# Altium schematic sheet COMMUNICATION.SchDoc
size A4; Author: Induja N/Karthik R; SheetNumber: 6; SheetTotal: 7
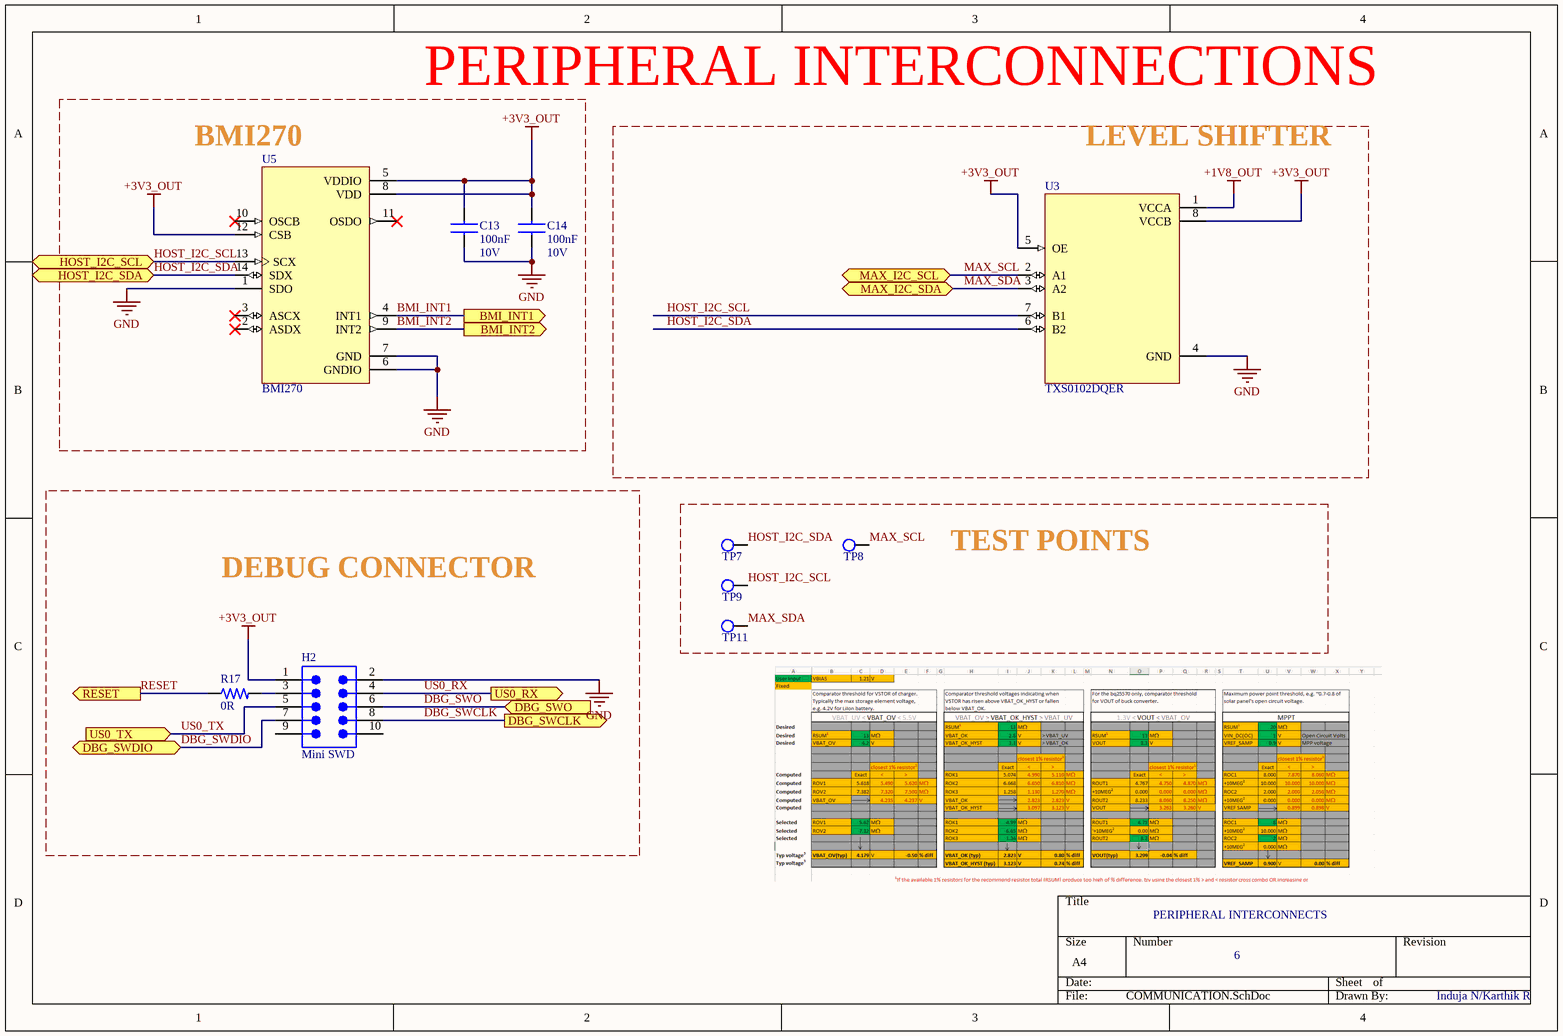
[diagram p0: COMMUNICATION.SchDoc]

## Parts
C13  value 100nF  Voltage Rating (DC): 10V  [CAP_0603_1MM]  (hidden comment: CAP 0.1uF 0603)
C14  value 100nF  Voltage Rating (DC): 10V  [CAP_0603_1MM]  (hidden comment: CAP 0.1uF 0603)
H2  Mini SWD  [FTSH-105-01-XXX-DV-K]
R17  value 0R  [RES_0603_1608X06]  (hidden comment: RES 0R 0603)
TP7  Test Point  [Test Point]  (value not drawn)  (net tie, no BOM)
TP8  Test Point  [Test Point]  (value not drawn)  (net tie, no BOM)
TP9  Test Point  [Test Point]  (value not drawn)  (net tie, no BOM)
TP11  Test Point  [Test Point]  (value not drawn)  (net tie, no BOM)
U3  TXS0102DQER  [SON35P140X100X40-8N]
U5  BMI270  [XDCR_BMI270]

## Blocks framed on the sheet
PERIPHERAL INTERCONNECTIONS: C13 C14 U5
LEVEL SHIFTER: U3
DEBUG CONNECTOR: H2 R17
TEST POINTS: TP7-TP9 TP11

## Ports
BMI_INT1 (out, see EFR32BG13_INTERCONNECTS[3C]), BMI_INT2 (out, see EFR32BG13_INTERCONNECTS[3C]), DBG_SWCLK (out, see EFR32BG13_INTERCONNECTS[3C]), DBG_SWDIO (bidir, see EFR32BG13_INTERCONNECTS[3C]), DBG_SWO (in, see EFR32BG13_INTERCONNECTS[3C]), HOST_I2C_SCL (bidir, see EFR32BG13_INTERCONNECTS[3B]), HOST_I2C_SDA (bidir, see EFR32BG13_INTERCONNECTS[3B]), MAX_I2C_SCL (bidir, see HEART_RATE[1B]), MAX_I2C_SDA (bidir, see HEART_RATE[1B]), RESET (out, see EFR32G13_POWER_RESET[1A]), US0_RX (out, see EFR32BG13_INTERCONNECTS[3C]), US0_TX (in, see EFR32BG13_INTERCONNECTS[3C])

## Nets
+1V8_OUT: U3.1(VCCA)
+3V3_OUT: C13.1 C14.1 H2.1 U3.5(OE) U3.8(VCCB) U5.5(VDDIO) U5.8(VDD) U5.12(CSB)
GND: C13.2 C14.2 H2.2 U3.4(GND) U5.1(SDO) U5.6(GNDIO) U5.7(GND)
BMI_INT1: U5.4(INT1) ; port BMI_INT1
BMI_INT2: U5.9(INT2) ; port BMI_INT2
DBG_SWCLK: H2.8 ; port DBG_SWCLK
DBG_SWDIO: H2.7 ; port DBG_SWDIO
DBG_SWO: H2.6 ; port DBG_SWO
HOST_I2C_SCL: TP9.1 U3.7(B1) U5.13(SCX) ; port HOST_I2C_SCL
HOST_I2C_SDA: TP7.1 U3.6(B2) U5.14(SDX) ; port HOST_I2C_SDA
MAX_SCL: TP8.1 U3.2(A1) ; port MAX_I2C_SCL
MAX_SDA: TP11.1 U3.3(A2) ; port MAX_I2C_SDA
RESET: R17.1 ; port RESET
US0_RX: H2.4 ; port US0_RX
US0_TX: H2.5 ; port US0_TX
NetH2_3: H2.3 R17.2

Not connected (* = marked no-connect by the designer): H2 9 10; U5 2(ASDX)* 3(ASCX)* 10(OSCB)* 11(OSDO)*

## Notes on the sheet
- (near U5) BMI270
- PERIPHERAL INTERCONNECTS

## Library data of the parts
C13 C14 = CAP 0.1uF 0603: 0603 0.1 uF 10 V ±10% Tolerance X7R SMT Multilayer Ceramic Chip Capacitor; Manufacturer: Vishay; Manufacturer Part Number: VJ0603Y104KXQCW1BC; Supplier: Newark; Supplier Part Number: 77AK2911; RoHS: Compliant; Category: Ceramic Capacitors; Stock: 20000; Pricing: 4000=0.028, 8000=0.026 (USD); Case/Package: 0603; Case Code (Imperial): 0603; Case Code (Metric): 1608; China RoHS: Compliant; Depth: 800µm; Dielectric: X7R; Dielectric Material: Ceramic; Height: 870µm; Lead Free: Lead Free; Length: 1.6mm; Lifecycle Status: Production; Max Operating Temperature: 125°C; Min Operating Temperature: -55°C; Mounting Technology: Surface Mount; Number of Terminals: 2; REACH SVHC: Yes; Schedule B: 8532240020, 8532240020|8532240020|8532240020|8532240020|8532240020; Termination: SMD/SMT; Tolerance: 10%; Width: 800µm; ComponentLink1URL: https://datasheet.octopart.com:443/VJ0603Y104KXQCW1BC-Vishay-datasheet-182138897.pdf?src-supplier=IHS; ComponentLink1Description: https://datasheet.octopart.com:443/VJ0603Y104KXQCW1BC-Vishay-datasheet-182138897.pdf?src-supplier=IHS; ComponentLink2URL: https://datasheet.octopart.com:443/VJ0603Y104KXQCW1BC-Vishay-datasheet-182137611.pdf?src-supplier=IHS; ComponentLink2Description: https://datasheet.octopart.com:443/VJ0603Y104KXQCW1BC-Vishay-datasheet-182137611.pdf?src-supplier=IHS; ComponentLink3URL: https://datasheet.octopart.com:443/VJ0603Y104KXQCW1BC-Vishay-datasheet-79783898.pdf?src-supplier=Future+Electronics; ComponentLink3Description: https://datasheet.octopart.com:443/VJ0603Y104KXQCW1BC-Vishay-datasheet-79783898.pdf?src-supplier=Future+Electronics; ComponentLink4URL: https://datasheet.octopart.com/VJ0603Y104KXQCW1BC-Vishay-datasheet-13530908.pdf; ComponentLink4Description: https://datasheet.octopart.com/VJ0603Y104KXQCW1BC-Vishay-datasheet-13530908.pdf; ComponentLink5URL: https://datasheet.octopart.com/VJ0603Y104KXQCW1BC-Vishay-datasheet-13436109.pdf; ComponentLink5Description: https://datasheet.octopart.com/VJ0603Y104KXQCW1BC-Vishay-datasheet-13436109.pdf; ComponentLink6URL: https://datasheet.octopart.com/VJ0603Y104KXQCW1BC-Vishay-datasheet-13168783.pdf; ComponentLink6Description: https://datasheet.octopart.com/VJ0603Y104KXQCW1BC-Vishay-datasheet-13168783.pdf; ComponentLink7URL: https://datasheet.octopart.com/VJ0603Y104KXQCW1BC-Vishay-datasheet-13134009.pdf; ComponentLink7Description: https://datasheet.octopart.com/VJ0603Y104KXQCW1BC-Vishay-datasheet-13134009.pdf; ComponentLink8URL: https://datasheet.octopart.com/VJ0603Y104KXQCW1BC-Vishay-datasheet-13055807.pdf; ComponentLink8Description: https://datasheet.octopart.com/VJ0603Y104KXQCW1BC-Vishay-datasheet-13055807.pdf; ComponentLink9URL: https://datasheet.octopart.com/VJ0603Y104KXQCW1BC-Vishay-datasheet-13029350.pdf; ComponentLink9Description: https://datasheet.octopart.com/VJ0603Y104KXQCW1BC-Vishay-datasheet-13029350.pdf; ComponentLink10URL: https://datasheet.octopart.com/VJ0603Y104KXQCW1BC-Vishay-datasheet-12584848.pdf; ComponentLink10Description: https://datasheet.octopart.com/VJ0603Y104KXQCW1BC-Vishay-datasheet-12584848.pdf; ComponentLink11URL: https://datasheet.octopart.com/VJ0603Y104KXQCW1BC-Vishay-datasheet-12543093.pdf; ComponentLink11Description: https://datasheet.octopart.com/VJ0603Y104KXQCW1BC-Vishay-datasheet-12543093.pdf; ComponentLink12URL: https://datasheet.octopart.com/VJ0603Y104KXQCW1BC-Vishay-datasheet-12532924.pdf; ComponentLink12Description: https://datasheet.octopart.com/VJ0603Y104KXQCW1BC-Vishay-datasheet-12532924.pdf; ComponentLink13URL: https://datasheet.octopart.com/VJ0603Y104KXQCW1BC-Vishay-datasheet-12519409.pdf; ComponentLink13Description: https://datasheet.octopart.com/VJ0603Y104KXQCW1BC-Vishay-datasheet-12519409.pdf; ComponentLink14URL: https://datasheet.octopart.com/VJ0603Y104KXQCW1BC-Vishay-datasheet-12509873.pdf; ComponentLink14Description: https://datasheet.octopart.com/VJ0603Y104KXQCW1BC-Vishay-datasheet-12509873.pdf; ComponentLink15URL: http://sigma.octopart.com:80/rohs_statement/Vishay-company-15.pdf?src-supplier=Compliance+Statements; ComponentLink15Description: http://sigma.octopart.com:80/rohs_statement/Vishay-company-15.pdf?src-supplier=Compliance+Statements; Supplier 1: DigiKey; Supplier Part Number 1: 720-1689-1-ND
H2 = Debug Connector Mini SWD - 0.05": Mini SWD 0.05" Pitch Connector - 10 Pin SMT Box Header; Manufacturer: Adafruit Industries; Manufacturer Part Number: 4048; Supplier 1: Digi-Key; RoHS: No; Category: Connectors; Stock 1: 201; Pricing 1: 1=1.95000 (USD); ComponentLink1URL: https://media.digikey.com/pdf/Data%20Sheets/Adafruit%20PDFs/4048_Web.pdf?src-supplier=Digi-Key; ComponentLink1Description: https://media.digikey.com/pdf/Data%20Sheets/Adafruit%20PDFs/4048_Web.pdf?src-supplier=Digi-Key
R17 = RES 0R 0603: GENERAL PURPOSE CHIP RESISTOR Metal Glaze/thick Film, 0.1W, 0ohm, Surface Mount, 0603; Manufacturer: Yageo Group; Manufacturer Part Number: RC0603JR-070RL; Power Dissipation: 100mW; Temperature Coefficient: 200ppm/°C; Tolerance: 1%; Voltage Rating: 50V; Supplier: Newark; Supplier Part Number: 68X3182; RoHS: Compliant; Category: Chip SMD Resistors; Stock: 1605000; Pricing: 5000=0.003 (USD); Case/Package: 0603; Case Code (Imperial): 0603; China RoHS: Non-Compliant; Composition: Thick Film; Contact Plating: Tin; Depth: 800µm; Height: 450µm; Lead Free: Lead Free; Length: 1.6mm; Lifecycle Status: Production; Max Operating Temperature: 155°C; Military Standard: Not; Min Operating Temperature: -55°C; Mounting Technology: Surface Mount; Pins: 2; Number of Terminals: 2; Packaging: Cut Tape; Power Rating: 100mW; Radiation Hardening: No; REACH SVHC: Yes; Termination: SMD/SMT; Voltage Rating (DC): 50V; Width: 800µm; ComponentLink1URL: https://datasheet.octopart.com:443/RC0603JR-070RL-Yageo-datasheet-182189538.pdf?src-supplier=IHS; ComponentLink1Description: https://datasheet.octopart.com:443/RC0603JR-070RL-Yageo-datasheet-182189538.pdf?src-supplier=IHS; ComponentLink2URL: https://datasheet.octopart.com:443/RC0603JR-070RL-Yageo-datasheet-8328172.pdf?src-supplier=element14+APAC; ComponentLink2Description: https://datasheet.octopart.com:443/RC0603JR-070RL-Yageo-datasheet-8328172.pdf?src-supplier=element14+APAC; ComponentLink3URL: https://datasheet.octopart.com:443/RC0603JR-070RL-Yageo-datasheet-17842380.pdf?src-supplier=element14+APAC; ComponentLink3Description: https://datasheet.octopart.com:443/RC0603JR-070RL-Yageo-datasheet-17842380.pdf?src-supplier=element14+APAC; ComponentLink4URL: https://datasheet.octopart.com:443/RC0603JR-070RL-Yageo-datasheet-62067350.pdf?src-supplier=Farnell; ComponentLink4Description: https://datasheet.octopart.com:443/RC0603JR-070RL-Yageo-datasheet-62067350.pdf?src-supplier=Farnell; ComponentLink5URL: https://datasheet.octopart.com:443/RC0603JR-070RL-Yageo-datasheet-15599030.pdf?src-supplier=Future+Electronics; ComponentLink5Description: https://datasheet.octopart.com:443/RC0603JR-070RL-Yageo-datasheet-15599030.pdf?src-supplier=Future+Electronics; ComponentLink6URL: https://datasheet.octopart.com:443/RC0603JR-070RL-Yageo-datasheet-164759695.pdf?src-supplier=Future+Electronics; ComponentLink6Description: https://datasheet.octopart.com:443/RC0603JR-070RL-Yageo-datasheet-164759695.pdf?src-supplier=Future+Electronics; ComponentLink7URL: https://datasheet.octopart.com:443/RC0603JR-070RL-Yageo-datasheet-137700087.pdf?src-supplier=Future+Electronics; ComponentLink7Description: https://datasheet.octopart.com:443/RC0603JR-070RL-Yageo-datasheet-137700087.pdf?src-supplier=Future+Electronics; ComponentLink8URL: https://datasheet.octopart.com:443/RC0603JR-070RL-Yageo-datasheet-27584510.pdf?src-supplier=Future+Electronics; ComponentLink8Description: https://datasheet.octopart.com:443/RC0603JR-070RL-Yageo-datasheet-27584510.pdf?src-supplier=Future+Electronics; ComponentLink9URL: https://datasheet.octopart.com:443/RC0603JR-070RL-Yageo-datasheet-503470.pdf?src-supplier=Future+Electronics; ComponentLink9Description: https://datasheet.octopart.com:443/RC0603JR-070RL-Yageo-datasheet-503470.pdf?src-supplier=Future+Electronics; ComponentLink10URL: https://datasheet.octopart.com:443/RC0603JR-070RL-Yageo-datasheet-12596169.pdf?src-supplier=Newark; ComponentLink10Description: https://datasheet.octopart.com:443/RC0603JR-070RL-Yageo-datasheet-12596169.pdf?src-supplier=Newark; ComponentLink11URL: https://datasheet.octopart.com:443/RC0603JR-070RL-Yageo-datasheet-34211833.pdf?src-supplier=Newark; ComponentLink11Description: https://datasheet.octopart.com:443/RC0603JR-070RL-Yageo-datasheet-34211833.pdf?src-supplier=Newark; ComponentLink12URL: https://datasheet.octopart.com:443/RC0603JR-070RL-Yageo-datasheet-79472498.pdf?src-supplier=Megastar; ComponentLink12Description: https://datasheet.octopart.com:443/RC0603JR-070RL-Yageo-datasheet-79472498.pdf?src-supplier=Megastar; ComponentLink13URL: https://datasheet.octopart.com/RC0603JR-070RL-Yageo-datasheet-73766026.pdf; ComponentLink13Description: https://datasheet.octopart.com/RC0603JR-070RL-Yageo-datasheet-73766026.pdf; ComponentLink14URL: https://datasheet.octopart.com:443/RC0603JR-070RL-Yageo-datasheet-5393049.pdf?src-supplier=element14; ComponentLink14Description: https://datasheet.octopart.com:443/RC0603JR-070RL-Yageo-datasheet-5393049.pdf?src-supplier=element14; ComponentLink15URL: https://datasheet.octopart.com:443/RC0603JR-070RL-Yageo-datasheet-118562.pdf?src-supplier=DigiKey; ComponentLink15Description: https://datasheet.octopart.com:443/RC0603JR-070RL-Yageo-datasheet-118562.pdf?src-supplier=DigiKey; ComponentLink16URL: http://sigma.octopart.com:80/rohs_statement/Yageo-company-2.pdf?src-supplier=Compliance+Statements; ComponentLink16Description: http://sigma.octopart.com:80/rohs_statement/Yageo-company-2.pdf?src-supplier=Compliance+Statements; ComponentLink17URL: http://sigma.octopart.com:80/conflict_mineral_statement/Yageo-company-3.pdf?src-supplier=Compliance+Statements; ComponentLink17Description: http://sigma.octopart.com:80/conflict_mineral_statement/Yageo-company-3.pdf?src-supplier=Compliance+Statements; Supplier 1: DigiKey; Supplier Part Number 1: RMCF0603ZT0R00TR-ND
U3 = TXS0102DQER: 2-Bit Bidirectional Voltage-Level Shifter for Open-Drain and Push-Pull Application; MF: Texas Instruments; SnapEDA_Link: https://www.snapeda.com/parts/TXS0102DQER/Texas+Instruments/view-part/?ref=snap; Package: X2SON-8 Texas Instruments; Value: *; MP: TXS0102DQER; Check_prices: https://www.snapeda.com/parts/TXS0102DQER/Texas+Instruments/view-part/?ref=eda; Supplier 1: DigiKey; Supplier Part Number 1: 296-28368-1-ND
U5 = BMI270: Accelerometer, Gyroscope, 6 Axis Sensor IÂ²C, SPI Output; MF: Bosch Sensortec; Digi-Key_Part_Number: 828-1091-2-ND; Check_prices: https://www.snapeda.com/parts/BMI270/Bosch+Sensortec/view-part/?ref=eda; MP: BMI270; Package: LGA-14 Bosch Sensortec; SnapEDA_Link: https://www.snapeda.com/parts/BMI270/Bosch+Sensortec/view-part/?ref=snap; Value: *; Purchase-URL: https://pricing.snapeda.com/search/part/BMI270/?ref=eda; Supplier 1: DigiKey; Supplier Part Number 1: 828-1091-1-ND